# Altium schematic sheet [01] Zasilacz.SchDoc
size 203 x 127 mm
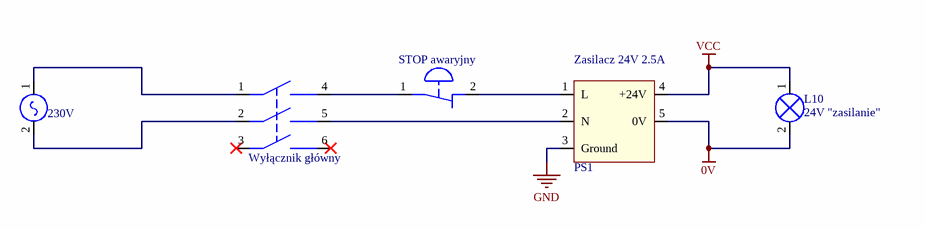
[diagram p0: [01] Zasilacz.SchDoc]

## Parts
*  230V
L10  24V "zasilanie"
PS1  Zasilacz 24V 2.5A
STOP_awaryjny  E-STOP 1 line  (value not drawn)
Wyłącznik_główny  Power switch  (value not drawn)

## Nets
0V: L10.2 PS1.5(0V)
GND: PS1.3(Ground)
VCC: L10.1 PS1.4(+24V)
Net*_1: *.1 Wyłącznik_główny.1
Net*_2: *.2 Wyłącznik_główny.2
NetPS1_1: PS1.1(L) STOP_awaryjny.2
NetPS1_2: PS1.2(N) Wyłącznik_główny.5
NetSTOP_awaryjny_1: STOP_awaryjny.1 Wyłącznik_główny.4

Not connected (* = marked no-connect by the designer): Wyłącznik_główny 3(16)* 6(19)*

## Library data of the parts
* = 230V source
L10 = Light
PS1 = Power supply